# Altium project pixel.PrjPcb
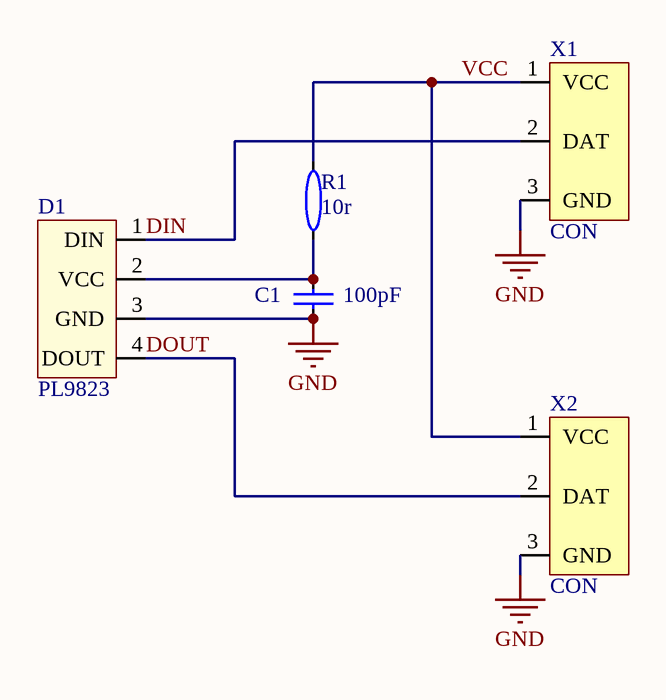
[diagram p0: pixel.SchDoc]
1 sheet, 5 parts. Net scope: global (net labels, ports and power ports of the same name join across sheets).
Board file: pixel.PcbDoc

## Sheet pixel.SchDoc
size A4

### Parts
C1  value 100pF  [0805 CAP]  (hidden comment: Cap)
D1  PL9823  [PL9823 5mm]
R1  value 10r  [RESC2012X05L]  (hidden comment: Res2)
X1  CON  [CON3]
X2  CON  [CON3]

### Nets
GND: C1.1 D1.3(GND) X1.3(GND) X2.3(GND)
DIN: D1.1(DIN) X1.2(DAT)
DOUT: D1.4(DOUT) X2.2(DAT)
VCC: R1.2 X1.1(VCC) X2.1(VCC)
NetC1_2: C1.2 D1.2(VCC) R1.1

### Library data of the parts
C1 = Cap: Capacitor; Published: 8-Jun-2000; LatestRevisionDate: 17-Jul-2002; LatestRevisionNote: Re-released for DXP Platform.; PackageReference: RAD-0.3; Publisher: Altium Limited; PackageDescription: Radial Cap, Thru-Hole; 2 Leads; 0.3 in Pin Spacing
R1 = Res2: Resistor; Published: 8-Jun-2000; LatestRevisionDate: 17-Jul-2002; LatestRevisionNote: Re-released for DXP Platform.; PackageReference: AXIAL-0.4; Publisher: Altium Limited; PackageDescription: Axial Device, Thru-Hole; 2 Leads; 0.4 in Pin Spacing